# EAGLE design Adafruit NeoPixel Ring 16 B (EAGLE 6.3)
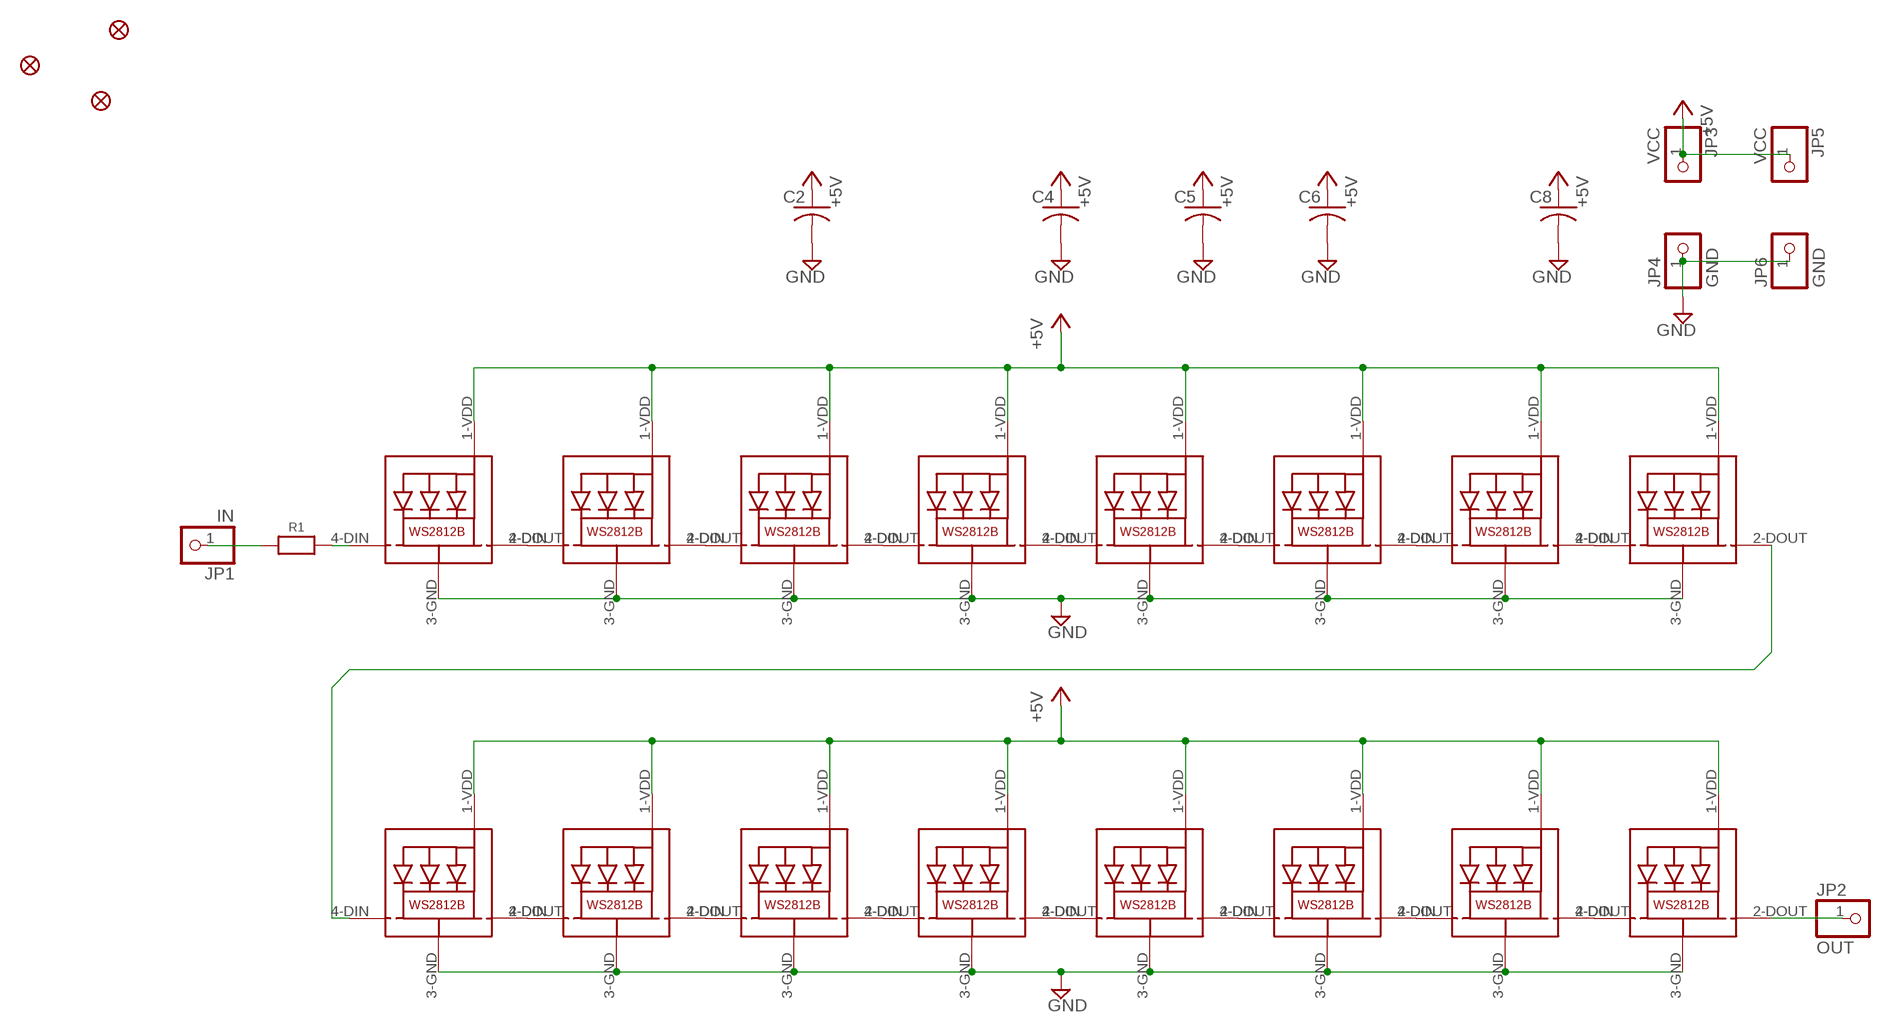
[diagram p0: schematic, sheet 1]

## Parts
C2  C-USC0603K  [C0603K]
C4  C-USC0603K  [C0603K]
C5  C-USC0603K  [C0603K]
C6  C-USC0603K  [C0603K]
C8  C-USC0603K  [C0603K]
FID1  FIDUCIAL""  [FIDUCIAL_1MM]
FID2  FIDUCIAL""  [FIDUCIAL_1MM]
FID3  FIDUCIAL""  [FIDUCIAL_1MM]
JP1  IN  PINHD-1X1CB  [1X01-CLEANBIG]
JP2  OUT  PINHD-1X1CB  [1X01-CLEANBIG]
JP3  VCC  PINHD-1X1CB  [1X01-CLEANBIG]
JP4  GND  PINHD-1X1CB  [1X01-CLEANBIG]
JP5  VCC  PINHD-1X1CB  [1X01-CLEANBIG]
JP6  GND  PINHD-1X1CB  [1X01-CLEANBIG]
LED1  WS2812B5050  [WS2812B]
LED2  WS2812B5050  [WS2812B]
LED3  WS2812B5050  [WS2812B]
LED4  WS2812B5050  [WS2812B]
LED5  WS2812B5050  [WS2812B]
LED6  WS2812B5050  [WS2812B]
LED7  WS2812B5050  [WS2812B]
LED8  WS2812B5050  [WS2812B]
LED9  WS2812B5050  [WS2812B]
LED10  WS2812B5050  [WS2812B]
LED11  WS2812B5050  [WS2812B]
LED12  WS2812B5050  [WS2812B]
LED13  WS2812B5050  [WS2812B]
LED14  WS2812B5050  [WS2812B]
LED15  WS2812B5050  [WS2812B]
LED16  WS2812B5050  [WS2812B]
R1  RESISTOR_0603_NOOUT  [0603-NO]

## Nets
+5V: C2.1 C4.1 C5.1 C6.1 C8.1 JP3.1 JP5.1 LED1.1-VDD(VDD) LED2.1-VDD(VDD) LED3.1-VDD(VDD) LED4.1-VDD(VDD) LED5.1-VDD(VDD) LED6.1-VDD(VDD) LED7.1-VDD(VDD) LED8.1-VDD(VDD) LED9.1-VDD(VDD) LED10.1-VDD(VDD) LED11.1-VDD(VDD) LED12.1-VDD(VDD) LED13.1-VDD(VDD) LED14.1-VDD(VDD) LED15.1-VDD(VDD) LED16.1-VDD(VDD)
GND: C2.2 C4.2 C5.2 C6.2 C8.2 JP4.1 JP6.1 LED1.3-GND(GND) LED2.3-GND(GND) LED3.3-GND(GND) LED4.3-GND(GND) LED5.3-GND(GND) LED6.3-GND(GND) LED7.3-GND(GND) LED8.3-GND(GND) LED9.3-GND(GND) LED10.3-GND(GND) LED11.3-GND(GND) LED12.3-GND(GND) LED13.3-GND(GND) LED14.3-GND(GND) LED15.3-GND(GND) LED16.3-GND(GND)
IN: JP1.1 R1.1
N$1: LED1.2-DOUT(DO) LED2.4-DIN(DI)
N$2: LED2.2-DOUT(DO) LED3.4-DIN(DI)
N$3: LED3.2-DOUT(DO) LED4.4-DIN(DI)
N$4: LED4.2-DOUT(DO) LED5.4-DIN(DI)
N$5: LED5.2-DOUT(DO) LED6.4-DIN(DI)
N$6: LED6.2-DOUT(DO) LED7.4-DIN(DI)
N$7: LED7.2-DOUT(DO) LED8.4-DIN(DI)
N$8: LED1.4-DIN(DI) R1.2
N$9: LED9.2-DOUT(DO) LED10.4-DIN(DI)
N$10: LED10.2-DOUT(DO) LED11.4-DIN(DI)
N$11: LED11.2-DOUT(DO) LED12.4-DIN(DI)
N$12: LED12.2-DOUT(DO) LED13.4-DIN(DI)
N$13: LED13.2-DOUT(DO) LED14.4-DIN(DI)
N$14: LED14.2-DOUT(DO) LED15.4-DIN(DI)
N$15: LED15.2-DOUT(DO) LED16.4-DIN(DI)
N$16: LED8.2-DOUT(DO) LED9.4-DIN(DI)
OUT: JP2.1 LED16.2-DOUT(DO)

## Library data of the parts
C2 C4-C6 C8 = rcl:C-US: CAPACITOR, American symbol
FID1-FID3 = microbuilder:FIDUCIAL: Fiducial Alignment Points Various fiducial points for machine vision alignment.; BOM: EXCLUDE
JP1-JP6 = adafruit:PINHD-1X1: Pin header 1x1 for 0.1" spacing With round pins
LED1-LED16 = microbuilder:WS2812B5050
R1 = microbuilder:RESISTOR: Resistors For new designs, use the packages preceded by an '_' character since they are more reliable: The following footprints should be used on most boards: _0402 - Standard footprint for regular board layouts _0603 - Standard footprint for regular board layouts _0805 - Standard footprint for regular board layouts _1206 - Standard footprint for regular board layouts For extremely tight-pitch boards where space is at a premium, the following 'micro-pitch' footprints can be used (smaller pads, no silkscreen outline, etc.): _0402MP - Micro-pitch footprint for very dense/compact boards _0603MP - Micro-pitch footprint for very dense/compact boards _0805MP - Micro-pitch footprint for very dense/compact boards _1206MP - Micro-pitch footprint for very dense/compact boards

## Board
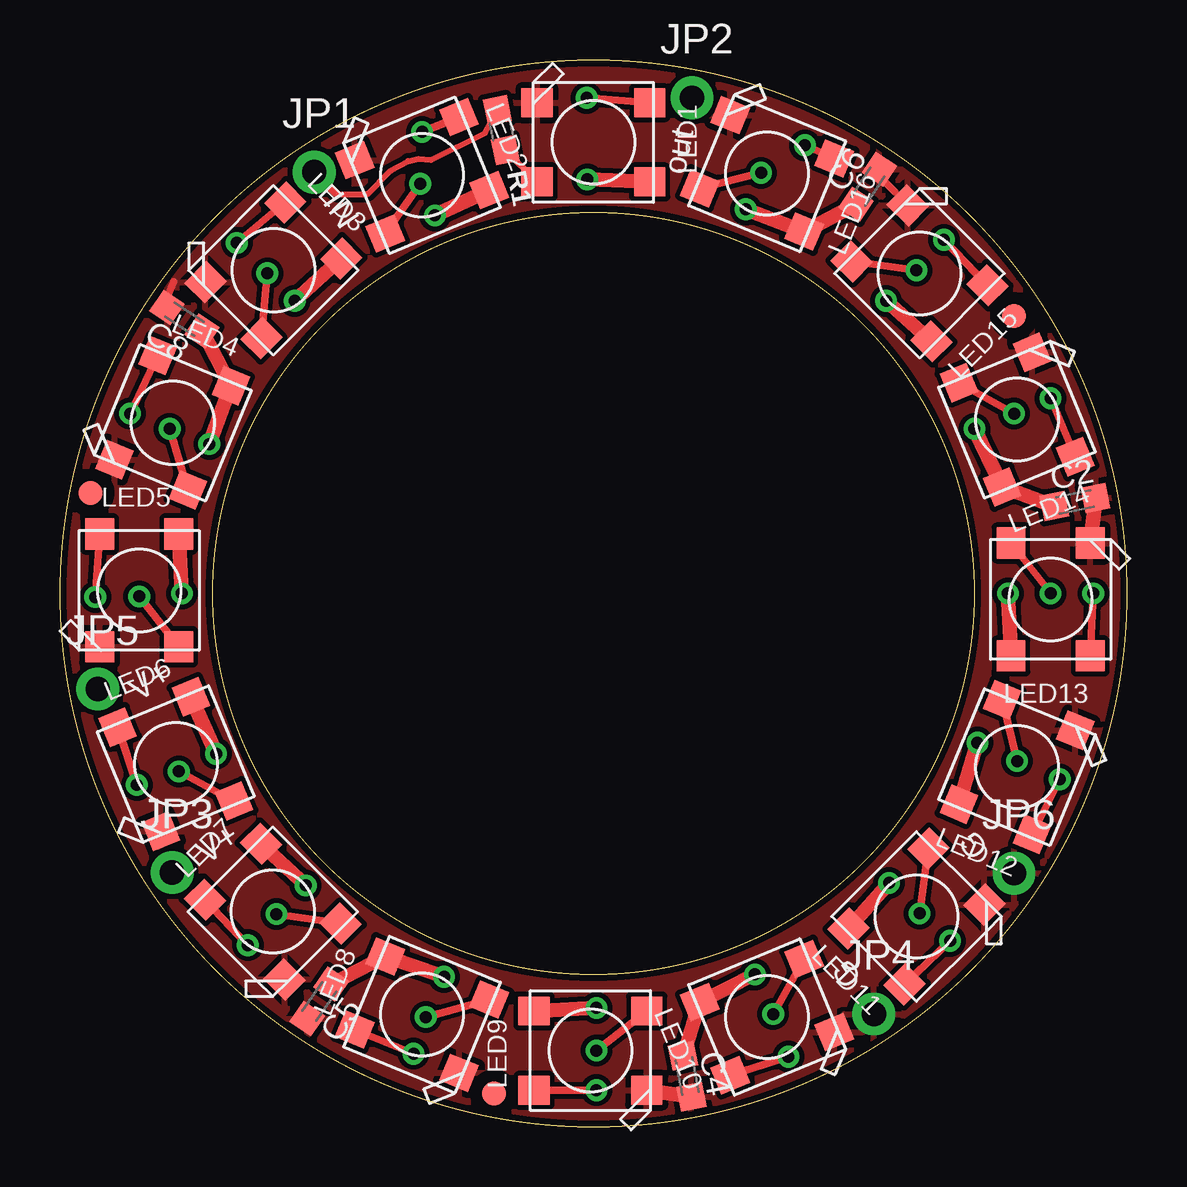
[diagram p1: board, top side]
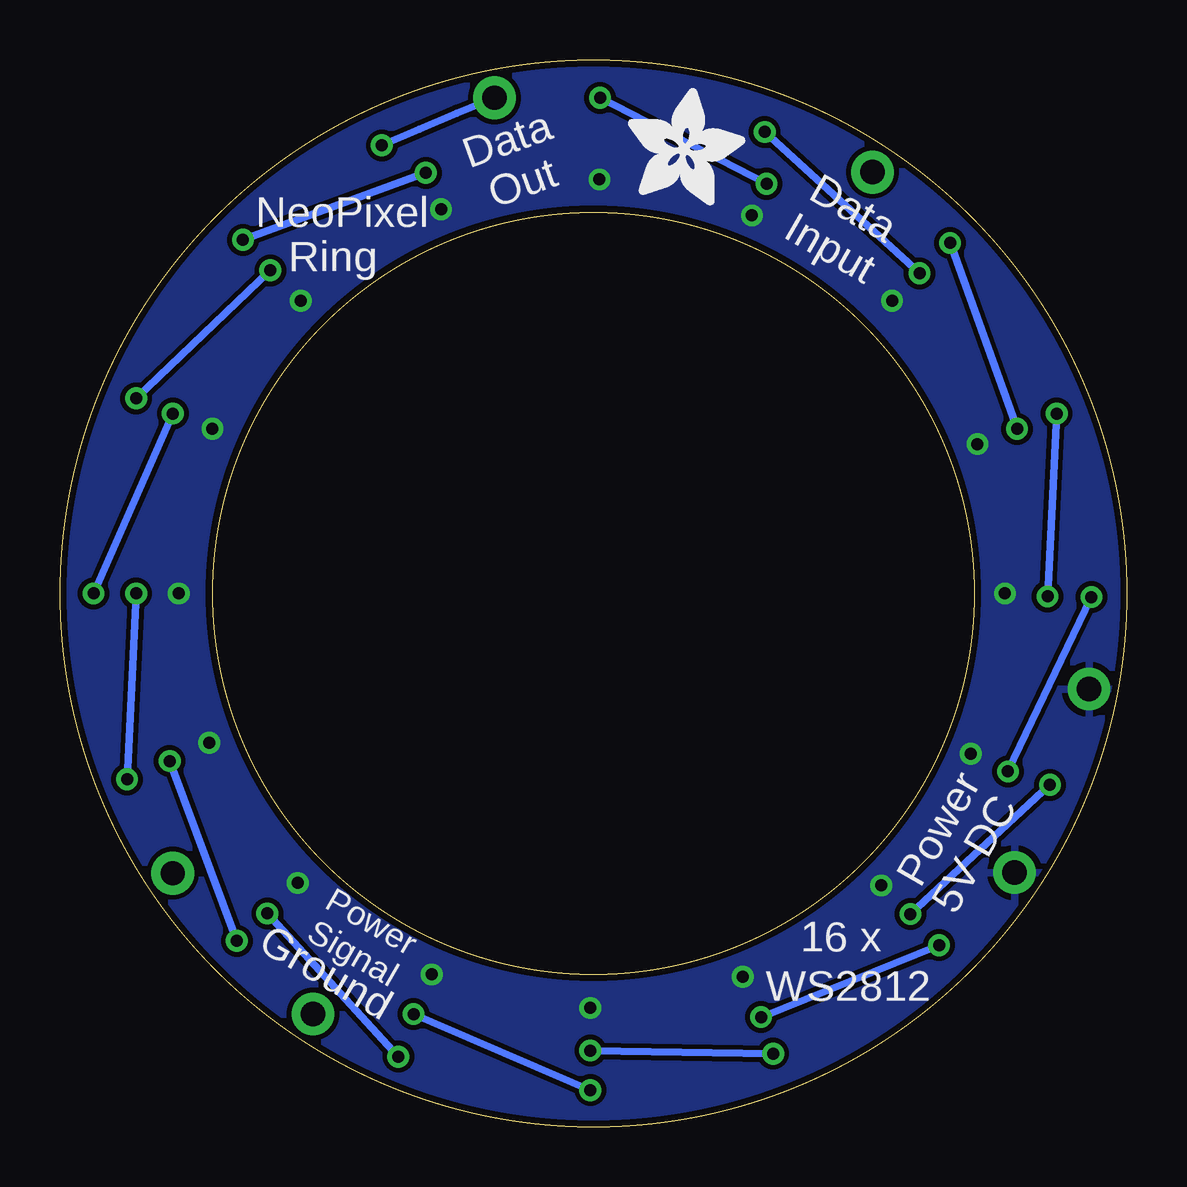
[diagram p2: board, bottom side, seen from below]

Size 44.45 x 44.45 mm. Coordinates in mm from the lower left corner, seen from the top.
Outline: circle at 22.23,22.23 radius 22.23
Outline: circle at 22.23,22.23 radius 15.88
Copper layers (1*16): Top 0.035mm / dielectric 1.5mm / Bottom 0.035mm
Design rules "adafruit *": minimum track width 8mil, minimum drill 15.5mil, track to track 8mil, track to pad 8mil, pad to pad 8mil, via to via 8mil, smd to smd 8mil, copper to edge 10mil, drill to drill 8mil, minimum pad ring 10mil, minimum via ring 8mil, stop-mask expansion 4mil, vias tented up to drill 20mil, thermal gap 10mil

### Footprints (pad centres in the part's own frame; a part is rotated, then mirrored left to right if it is on the bottom)
C0603K = smd 1.05 x 1.08: 1 -0.875,0; 2 0.875,0
FIDUCIAL_1MM = smd 1 x 1: 1 0,0
1X01-CLEANBIG = drill 1.016 pad 1.778: 1 0,0
WS2812B-NARROW = smd 1.3 x 1.2: 1-VDD 2.35,-1.65; 2-DOUT 2.35,1.65; 3-GND -2.35,1.65; 4-DIN -2.35,-1.65
0603-NO = smd 1.1 x 1: 1 -0.85,0; 2 0.85,0

### Placement (x,y rotation side)
C2  42.29,26.04 11.3 top
C4  26.14,2.11 281.3 top
C5  10.8,5.22 235.3 top
C6  33.66,39.17 56.3 top
C8  5.19,33.65 146.3 top
FID1  39.75,33.78 0 top
FID2  18.08,1.4 0 top
FID3  1.27,26.42 0 top
JP1  10.59,39.78 0 top
JP2  26.34,42.88 0 top
JP3  4.67,10.59 0 top
JP4  33.91,4.7 0 top
JP5  1.57,18.24 0 top
JP6  39.75,10.57 0 top
LED1  WS2812B5050  [WS2812B-NARROW]  22.23,41.02 0 top
LED2  WS2812B5050  [WS2812B-NARROW]  15.09,39.65 22.5 top
LED3  WS2812B5050  [WS2812B-NARROW]  8.89,35.69 45 top
LED4  WS2812B5050  [WS2812B-NARROW]  4.7,29.34 67.5 top
LED5  WS2812B5050  [WS2812B-NARROW]  3.3,22.35 90 top
LED6  WS2812B5050  [WS2812B-NARROW]  4.83,15.11 112.5 top
LED7  WS2812B5050  [WS2812B-NARROW]  8.86,8.97 135 top
LED8  WS2812B5050  [WS2812B-NARROW]  15.09,4.67 157.5 top
LED9  WS2812B5050  [WS2812B-NARROW]  22.1,3.18 180 top
LED10  WS2812B5050  [WS2812B-NARROW]  29.46,4.57 202.5 top
LED11  WS2812B5050  [WS2812B-NARROW]  35.69,8.76 225 top
LED12  WS2812B5050  [WS2812B-NARROW]  39.88,14.99 247.5 top
LED13  WS2812B5050  [WS2812B-NARROW]  41.28,21.97 270 top
LED14  WS2812B5050  [WS2812B-NARROW]  39.88,29.46 292.5 top
LED15  WS2812B5050  [WS2812B-NARROW]  35.81,35.56 315 top
LED16  WS2812B5050  [WS2812B-NARROW]  29.46,39.73 337.5 top
R1  18.39,41.53 281.3 top
U$2  [ADAFRUIT_5MM]  20.78,38.4 0 bottom

### Tracks (layer width: path | path; a pad name or v marks a point on that pad's centre or on a via)
+5V  (via drill 0.5)
  Top 0.61: v5.08,22.23 LED5.1-VDD | v6.22,28.45 LED4.1-VDD C8.1 | v9.78,34.42 LED3.1-VDD | v15.62,37.97 LED2.1-VDD | v21.97,39.47 LED1.1-VDD | v28.58,38.23 LED16.1-VDD C6.1 | LED15.1-VDD v34.42,34.42 | v38.1,29.08 LED14.1-VDD C2.1 | v39.5,22.23 LED13.1-VDD | LED12.1-VDD v38.23,16 | v34.54,10.16 LED11.1-VDD | v28.96,6.35 LED10.1-VDD C4.1 | LED9.1-VDD v22.35,4.95 | C5.1 LED8.1-VDD v16,6.25 | v10.24,10.06 LED7.1-VDD | v6.5,15.55 LED6.1-VDD
  pour Bottom: 45.09,22.23 arc90 22.23,45.09 arc90 -0.63,22.23 arc90 22.23,-0.63 arc90
GND
  Top 0.305: 4.45,34.52 4.75,35.2 | 34.27,39.47 34.77,38.96
  Top 0.61: C2.2 LED13.3-GND | C4.2 LED9.3-GND
  pour Top: 45.09,22.23 arc90 22.23,45.09 arc90 -0.63,22.23 arc90 22.23,-0.63 arc90
IN
  Top 0.254: JP1.1 10.59,39.75 11.48,38.86 12.8,38.86 13.77,39.83 14.5,40.23 14.94,40.34 15.47,40.28 17.7,41.4 R1.1
N$1  (via drill 0.5)
  Top 0.305: LED2.4-DIN v15.01,39.29 | v21.95,42.88 LED1.2-DOUT
  Bottom 0.305: v15.01,39.29 v21.95,42.88
N$2  (via drill 0.5)
  Top 0.305: LED3.4-DIN v8.64,35.56 | v15.09,41.45 LED2.2-DOUT
  Bottom 0.305: v8.64,35.56 v15.09,41.45
N$3  (via drill 0.5)
  Top 0.305: LED4.4-DIN v4.57,29.08 | v7.37,36.83 LED3.2-DOUT
  Bottom 0.305: v4.57,29.08 v7.37,36.83
N$4  (via drill 0.5)
  Top 0.305: v3.3,22.1 LED5.4-DIN | v2.92,29.72 LED4.2-DOUT
  Bottom 0.305: v3.3,22.1 v2.92,29.72
N$5  (via drill 0.5)
  Top 0.305: LED6.4-DIN v4.95,14.81 | v1.47,22.07 LED5.2-DOUT
  Bottom 0.305: v4.95,14.81 v1.47,22.07
N$6  (via drill 0.5)
  Top 0.305: v9.02,8.87 LED7.4-DIN | v3.2,14.25 LED6.2-DOUT
  Bottom 0.305: v9.02,8.87 v3.2,14.25
N$7  (via drill 0.5)
  Top 0.305: LED8.4-DIN v15.24,4.57 | v7.82,7.57 LED7.2-DOUT
  Bottom 0.305: v15.24,4.57 v7.82,7.57
N$8
  Top 0.254: R1.2 LED1.4-DIN
N$9  (via drill 0.5)
  Top 0.305: LED10.4-DIN v29.72,4.7 | LED9.2-DOUT v22.35,1.52
  Bottom 0.305: v29.72,4.7 v22.35,1.52
N$10  (via drill 0.5)
  Top 0.305: LED11.4-DIN v35.81,8.89 | v30.35,2.92 LED10.2-DOUT
  Bottom 0.305: v30.35,2.92 v35.81,8.89
N$11  (via drill 0.5)
  Top 0.305: LED12.4-DIN v39.88,15.24 | LED11.2-DOUT v37.08,7.75
  Bottom 0.305: v39.88,15.24 v37.08,7.75
N$12  (via drill 0.5)
  Top 0.305: LED13.4-DIN v41.28,22.23 | v41.66,14.48 LED12.2-DOUT
  Bottom 0.305: v41.28,22.23 v41.66,14.48
N$13  (via drill 0.5)
  Top 0.305: LED14.4-DIN v39.75,29.72 | LED13.2-DOUT v43.05,22.23
  Bottom 0.305: v39.75,29.72 v43.05,22.23
N$14  (via drill 0.5)
  Top 0.305: LED15.4-DIN v35.69,35.69 | v41.28,30.35 LED14.2-DOUT
  Bottom 0.305: v35.69,35.69 v41.28,30.35
N$15  (via drill 0.5)
  Top 0.305: LED16.4-DIN v29.21,39.75 | v36.83,36.96 LED15.2-DOUT
  Bottom 0.305: v29.21,39.75 v36.83,36.96
N$16  (via drill 0.5)
  Top 0.305: LED9.4-DIN v22.35,3.18 | LED8.2-DOUT v14.73,3.05
  Bottom 0.305: v22.35,3.18 v14.73,3.05
OUT  (via drill 0.5)
  Top 0.305: LED16.2-DOUT v31.04,40.89
  Bottom 0.305: v31.04,40.89 arc2 JP2.1

### Text on the board
tPlace: out | IN | V+ | V+ | G | G
bPlace: Data / Out | Data / Input | NeoPixel | Ring | Power | 5V DC | Power / Signal | 16 x | Ground | WS2812